# Altium schematic sheet SCS_Layout.SchDoc: PWM Motor Controller - CPU
size A3; DocumentNumber: 2; Revision: 2; SheetNumber: 2; SheetTotal: 5; DrawnBy: T. Burns; Organization: N/A; ProjectName: PWM Motor Controller
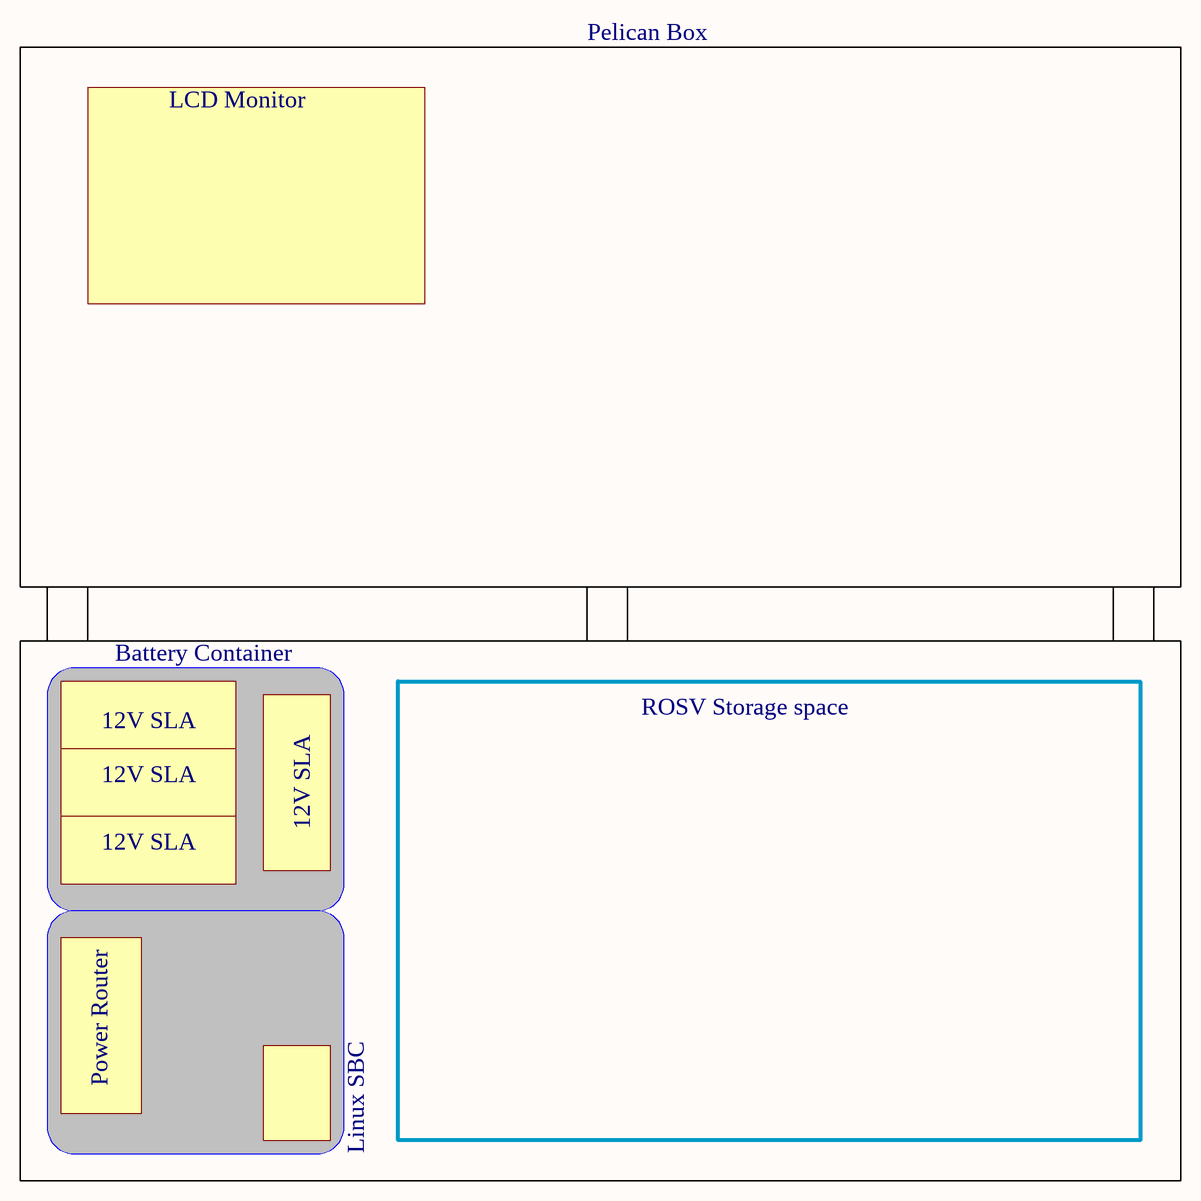
[diagram p0: SCS_Layout.SchDoc]

## Notes on the sheet
- Pelican Box
- LCD Monitor
- Battery Container
- 12V SLA
- ROSV Storage space
- Power Router
- Linux SBC
- Title
- Size:
- Date:
- A4
- Number:
- Time:
- Revision:
- Sheet
- of
- File: